# Altium schematic sheet SoC_PS.SchDoc: RFSOC_AMC
size 420 x 297 mm; Author: G.Kasprowicz; CompanyName: WUT ISE; DrawnBy: G.Kasprowicz; Organization: WUT ISE; Address1: PW ISE; Address2: Nowowiejska 15/19 00-665 Warsaw; Address3: gkasprow@gmail.com; DocumentNumber: 38; Revision: 2; SheetNumber: 38; SheetTotal: 54; ModifiedBy: -; CheckedDate: -; Title2: 8 channel ADC & DAC; DivGrp: WUT ISE; Designer: G.Kasprowicz; ModifiedDate: -; ProjectName: Sensor Box
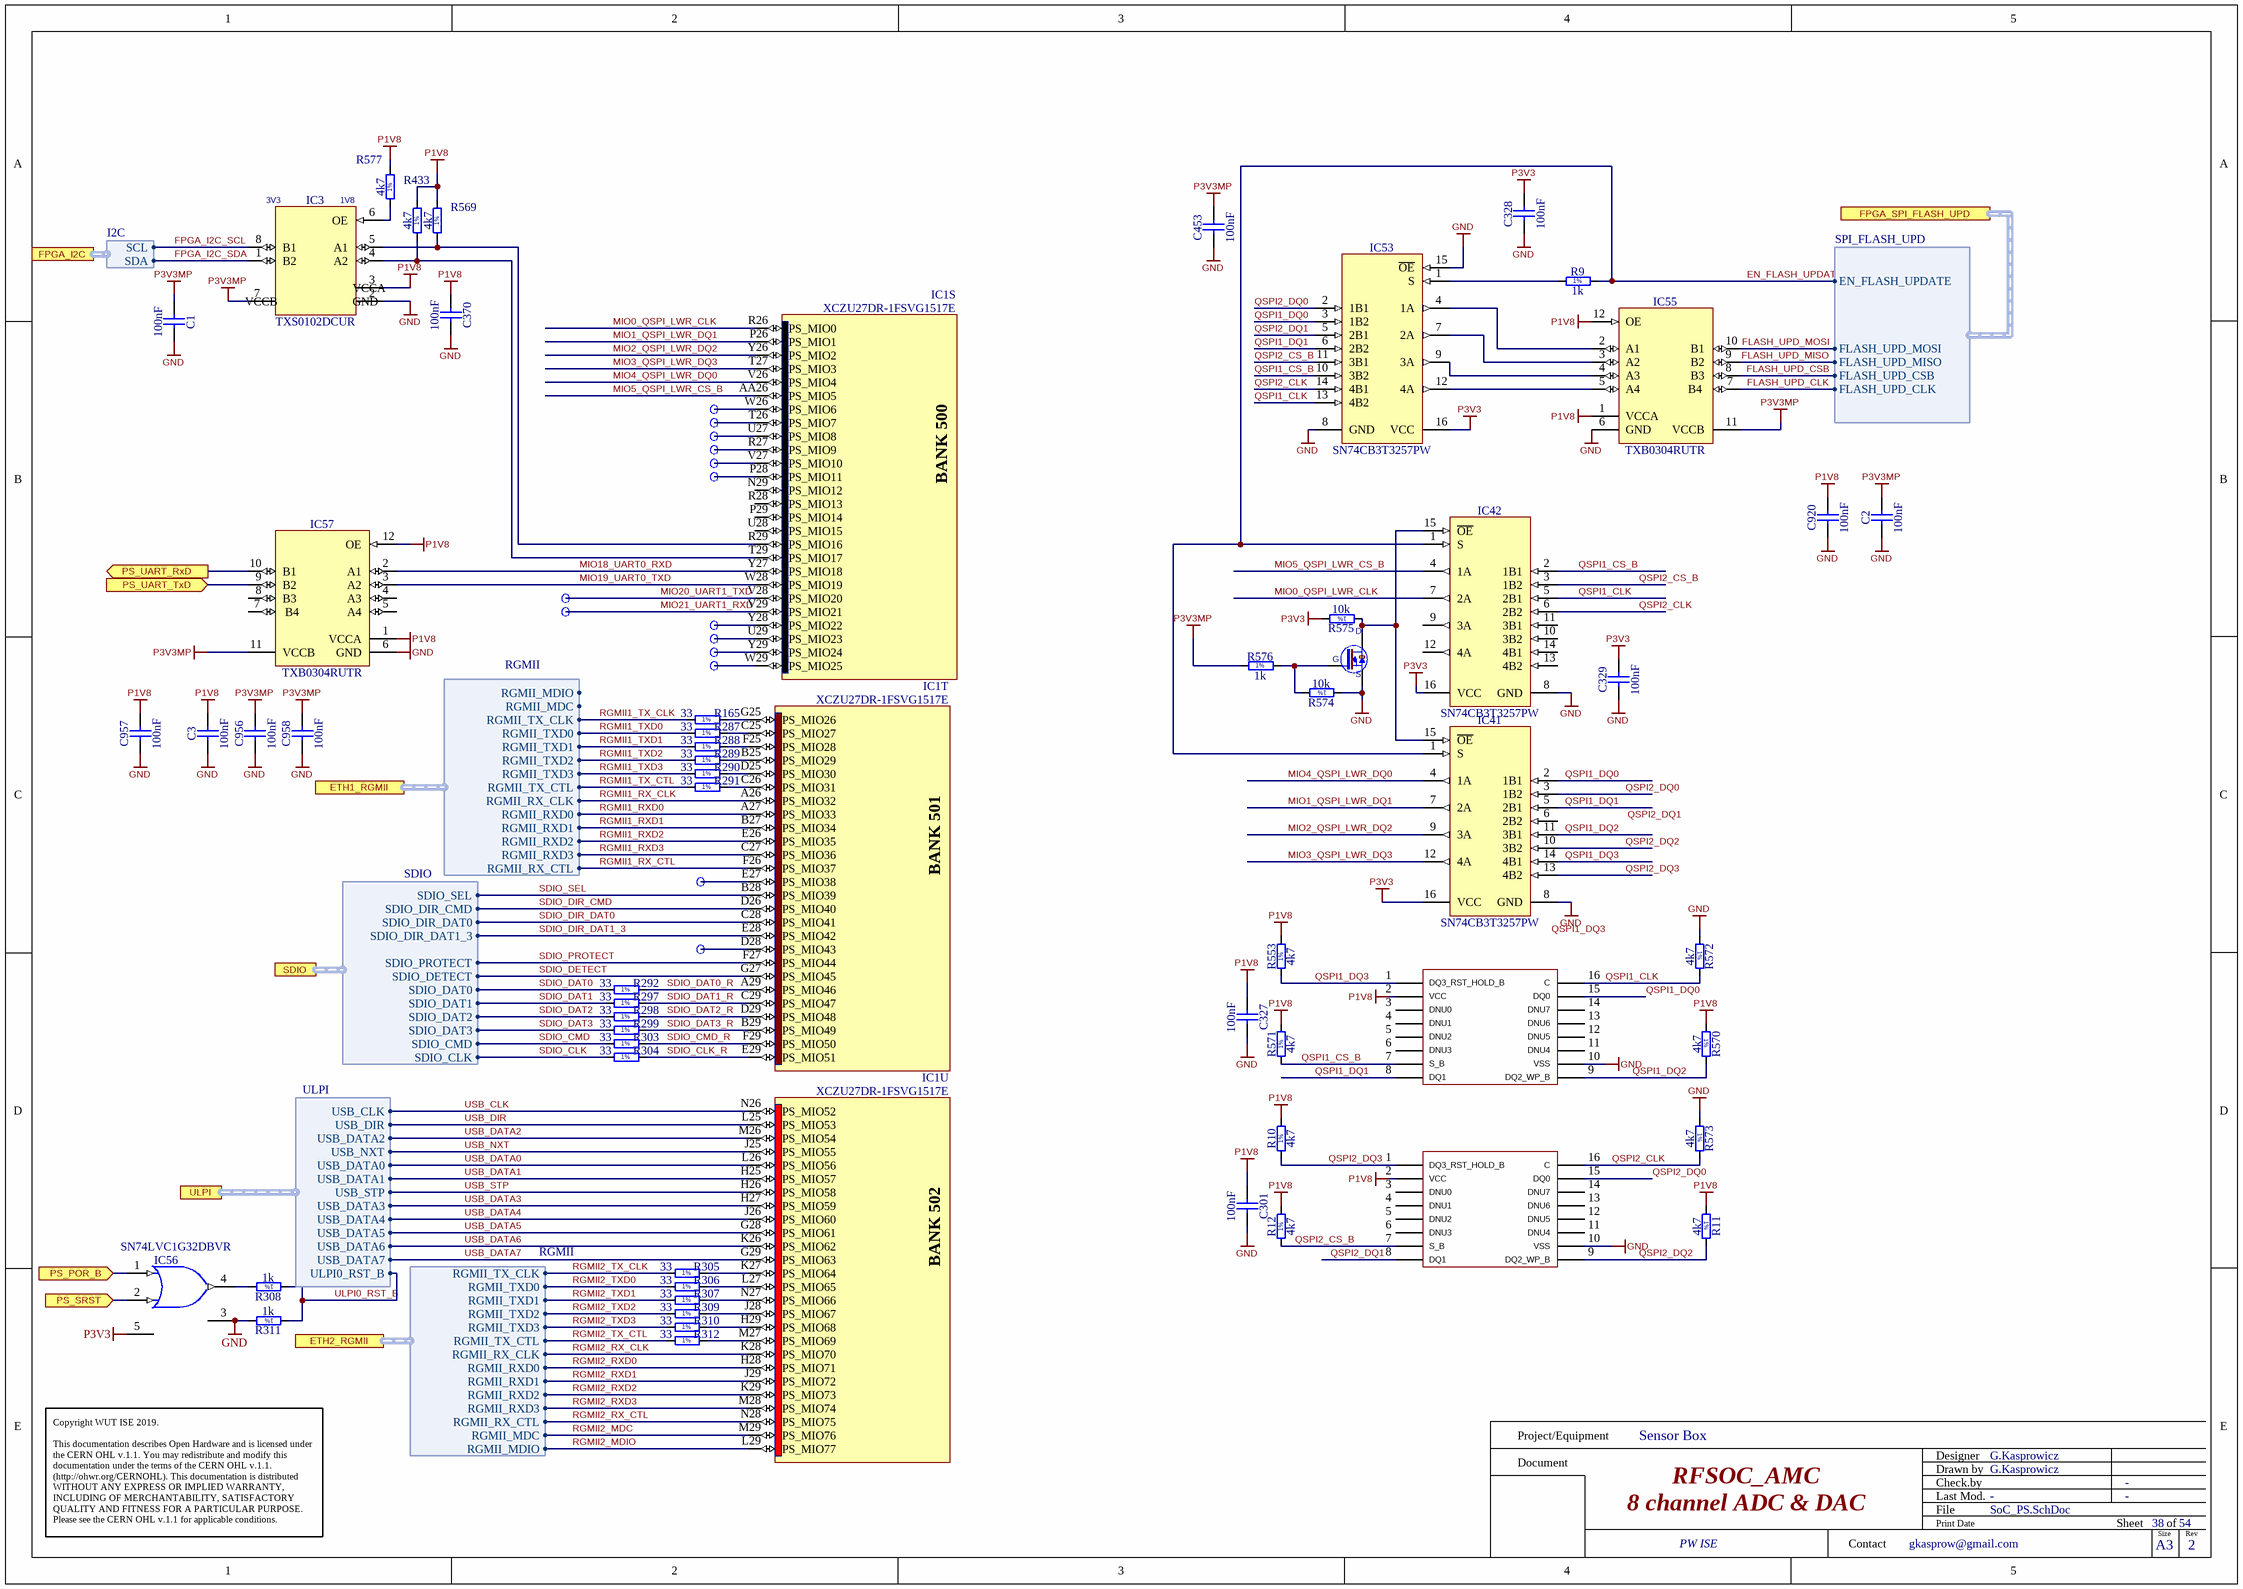
[diagram p0: SoC_PS.SchDoc]

## Parts
C1  100nF  [CAPC0603X33N]
C2  100nF  [CAPC0603X33N]
C3  100nF  [CAPC0603X33N]
C301  100nF  [CAPC0603X33N]
C327  100nF  [CAPC0603X33N]
C328  100nF  [CAPC0603X33N]
C329  100nF  [CAPC0603X33N]
C370  100nF  [CAPC0603X33N]
C453  100nF  [CAPC0603X33N]
C920  100nF  [CAPC0603X33N]
C956  100nF  [CAPC0603X33N]
C957  100nF  [CAPC0603X33N]
C958  100nF  [CAPC0603X33N]
IC1  XCZU27DR-1FSVG1517E  [XILINX_FSVG1517 (XCZU27DR)]  (parts S,T,U of 31)
IC3  TXS0102DCUR  [SOP50P310X90-8N]
IC37  MT25QU512ABB8ESF  [SOIC127P1032X265-16N]  (value not drawn)
IC40  MT25QU512ABB8ESF  [SOIC127P1032X265-16N]  (value not drawn)
IC41  SN74CB3T3257PW  [SOP65P640X120-16N]
IC42  SN74CB3T3257PW  [SOP65P640X120-16N]
IC53  SN74CB3T3257PW  [SOP65P640X120-16N]
IC55  TXB0304RUTR  [TEXAS_RUT (R-PUQFN-N12)]
IC56  SN74LVC1G32DBVR  [SOT95P280X145-5N]
IC57  TXB0304RUTR  [TEXAS_RUT (R-PUQFN-N12)]
R9  1k  [RESC1005X40N]
R10  4k7  [RESC1005X40N]
R11  4k7  [RESC1005X40N]
R12  4k7  [RESC1005X40N]
R165  33  [RESC1005X40N]
R287  33  [RESC1005X40N]
R288  33  [RESC1005X40N]
R289  33  [RESC1005X40N]
R290  33  [RESC1005X40N]
R291  33  [RESC1005X40N]
R292  33  [RESC1005X40N]
R297  33  [RESC1005X40N]
R298  33  [RESC1005X40N]
R299  33  [RESC1005X40N]
R303  33  [RESC1005X40N]
R304  33  [RESC1005X40N]
R305  33  [RESC1005X40N]
R306  33  [RESC1005X40N]
R307  33  [RESC1005X40N]
R308  1k  [RESC1005X40N]
R309  33  [RESC1005X40N]
R310  33  [RESC1005X40N]
R311  1k  [RESC1005X40N]
R312  33  [RESC1005X40N]
R433  4k7  [RESC1005X40N]
R553  4k7  [RESC1005X40N]
R569  4k7  [RESC1005X40N]
R570  4k7  [RESC1005X40N]
R571  4k7  [RESC1005X40N]
R572  4k7  [RESC1005X40N]
R573  4k7  [RESC1005X40N]
R574  10k  [RESC1005X40N]
R575  10k  [RESC1005X40N]
R576  1k  [RESC1005X40N]
R577  4k7  [RESC1005X40N]
T22  BSS138LT1G  (value not drawn)
TP11  SMD_PAD_D1MM  (value not drawn)
TP12  SMD_PAD_D1MM  (value not drawn)
TP13  SMD_PAD_D1MM  (value not drawn)
TP14  SMD_PAD_D1MM  (value not drawn)
TP15  SMD_PAD_D1MM  (value not drawn)
TP16  SMD_PAD_D1MM  (value not drawn)
TP17  SMD_PAD_D1MM  (value not drawn)
TP18  SMD_PAD_D1MM  (value not drawn)
TP19  SMD_PAD_D1MM  (value not drawn)
TP20  SMD_PAD_D1MM  (value not drawn)
TP21  SMD_PAD_D1MM  (value not drawn)
TP22  SMD_PAD_D1MM  (value not drawn)
TP23  SMD_PAD_D1MM  (value not drawn)
TP24  SMD_PAD_D1MM  (value not drawn)

## Ports
ETH1_RGMII (harness RGMII), ETH2_RGMII (harness RGMII), FPGA_I2C (harness I2C), FPGA_SPI_FLASH_UPD (harness SPI_FLASH_UPD), PS_POR_B (in), PS_SRST (in), PS_UART_RxD (out), PS_UART_TxD (in), SDIO (harness SDIO), ULPI (harness ULPI)

## Harnesses
SDIO: SDIO_SEL, SDIO_DIR_CMD, SDIO_DIR_DAT0, SDIO_DIR_DAT1_3, SDIO_PROTECT, SDIO_DETECT, SDIO_DAT0, SDIO_DAT1, SDIO_DAT2, SDIO_DAT3, SDIO_CMD, SDIO_CLK
SPI_FLASH_UPD: EN_FLASH_UPDATE, FLASH_UPD_MOSI, FLASH_UPD_MISO, FLASH_UPD_CSB, FLASH_UPD_CLK
I2C: SCL, SDA
ULPI: USB_CLK, USB_DIR, USB_DATA2, USB_NXT, USB_DATA0, USB_DATA1, USB_STP, USB_DATA3, USB_DATA4, USB_DATA5, USB_DATA6, USB_DATA7, ULPI0_RST_B
RGMII: RGMII_TX_CLK, RGMII_TXD0, RGMII_TXD1, RGMII_TXD2, RGMII_TXD3, RGMII_TX_CTL, RGMII_RX_CLK, RGMII_RXD0, RGMII_RXD1, RGMII_RXD2, RGMII_RXD3, RGMII_RX_CTL, RGMII_MDC, RGMII_MDIO

## Nets
GND: C1.1 C2.1 C3.1 C301.1 C327.1 C328.1 C329.1 C370.1 C453.1 C920.1 C956.1 C957.1 C958.1 IC3.2(GND) IC37.10(VSS) IC40.10(VSS) IC41.8(GND) IC42.8(GND) IC53.8(GND) IC53.15(~{OE}) IC55.6(GND) IC56.3(GND) IC57.6(GND) R311.2 R572.1 R573.1 R574.1 T22.2(S)
P1V8: C3.2 C301.2 C327.2 C370.2 C920.2 C957.2 IC3.3(Vcca) IC37.2(VCC) IC40.2(VCC) IC55.1(VCCA) IC55.12(OE) IC57.1(VCCA) IC57.12(OE) R10.2 R11.1 R12.2 R433.2 R553.2 R569.2 R570.1 R571.2 R577.2
P3V3: C328.2 C329.2 IC41.16(VCC) IC42.16(VCC) IC53.16(VCC) IC56.5(VCC) R575.2
P3V3MP: C1.2 C2.2 C453.2 C956.2 C958.2 IC3.7(Vccb) IC55.11(VCCB) IC57.11(VCCB) R576.1
EN_FLASH_UPDATE: IC41.1(S) IC42.1(S) R9.2 ; port FPGA_SPI_FLASH_UPD.EN_FLASH_UPDATE
FLASH_UPD_CLK: IC55.7(B4) ; port FPGA_SPI_FLASH_UPD.FLASH_UPD_CLK
FLASH_UPD_CSB: IC55.8(B3) ; port FPGA_SPI_FLASH_UPD.FLASH_UPD_CSB
FLASH_UPD_MISO: IC55.9(B2) ; port FPGA_SPI_FLASH_UPD.FLASH_UPD_MISO
FLASH_UPD_MOSI: IC55.10(B1) ; port FPGA_SPI_FLASH_UPD.FLASH_UPD_MOSI
FPGA_I2C_SCL: IC3.8(B1) ; port FPGA_I2C.SCL
FPGA_I2C_SDA: IC3.1(B2) ; port FPGA_I2C.SDA
MIO0_QSPI_LWR_CLK: IC1.R26(PS_MIO0) IC42.7(2A)
MIO1_QSPI_LWR_DQ1: IC1.P26(PS_MIO1) IC41.7(2A)
MIO2_QSPI_LWR_DQ2: IC1.Y26(PS_MIO2) IC41.9(3A)
MIO3_QSPI_LWR_DQ3: IC1.T27(PS_MIO3) IC41.12(4A)
MIO4_QSPI_LWR_DQ0: IC1.V26(PS_MIO4) IC41.4(1A)
MIO5_QSPI_LWR_CS_B: IC1.AA26(PS_MIO5) IC42.4(1A)
MIO18_UART0_RXD: IC1.Y27(PS_MIO18) IC57.2(A1)
MIO19_UART0_TXD: IC1.W28(PS_MIO19) IC57.3(A2)
MIO20_UART1_TXD: IC1.V28(PS_MIO20) TP22.1
MIO21_UART1_RXD: IC1.V29(PS_MIO21) TP23.1
PS_POR_B: IC56.1(A) ; port PS_POR_B
PS_SRST: IC56.2(B) ; port PS_SRST
PS_UART_RxD: IC57.10(B1) ; port PS_UART_RxD
PS_UART_TxD: IC57.9(B2) ; port PS_UART_TxD
QSPI1_CLK: IC37.16(C) IC42.5(2B1) IC53.13(4B2) R572.2
QSPI1_CS_B: IC37.7(S_B) IC42.2(1B1) IC53.10(3B2) R571.1
QSPI1_DQ0: IC37.15(DQ0) IC41.2(1B1) IC53.3(1B2)
QSPI1_DQ1: IC37.8(DQ1) IC41.5(2B1) IC53.6(2B2)
QSPI1_DQ2: IC37.9(DQ2_WP_B) IC41.11(3B1) R570.2
QSPI1_DQ3: IC37.1(DQ3_RST_HOLD_B) IC41.14(4B1) R553.1
QSPI2_CLK: IC40.16(C) IC42.6(2B2) IC53.14(4B1) R573.2
QSPI2_CS_B: IC40.7(S_B) IC42.3(1B2) IC53.11(3B1) R12.1
QSPI2_DQ0: IC40.15(DQ0) IC41.3(1B2) IC53.2(1B1)
QSPI2_DQ1: IC40.8(DQ1) IC53.5(2B1)
QSPI2_DQ2: IC40.9(DQ2_WP_B) IC41.10(3B2) R11.2
QSPI2_DQ3: IC40.1(DQ3_RST_HOLD_B) IC41.13(4B2) R10.1
RGMII1_RX_CLK: IC1.A26(PS_MIO32) ; port ETH1_RGMII.RGMII_RX_CLK
RGMII1_RX_CTL: IC1.F26(PS_MIO37) ; port ETH1_RGMII.RGMII_RX_CTL
RGMII1_RXD0: IC1.A27(PS_MIO33) ; port ETH1_RGMII.RGMII_RXD0
RGMII1_RXD1: IC1.B27(PS_MIO34) ; port ETH1_RGMII.RGMII_RXD1
RGMII1_RXD2: IC1.E26(PS_MIO35) ; port ETH1_RGMII.RGMII_RXD2
RGMII1_RXD3: IC1.C27(PS_MIO36) ; port ETH1_RGMII.RGMII_RXD3
RGMII1_TX_CLK: R165.1 ; port ETH1_RGMII.RGMII_TX_CLK
RGMII1_TX_CTL: R291.1 ; port ETH1_RGMII.RGMII_TX_CTL
RGMII1_TXD0: R287.1 ; port ETH1_RGMII.RGMII_TXD0
RGMII1_TXD1: R288.1 ; port ETH1_RGMII.RGMII_TXD1
RGMII1_TXD2: R289.1 ; port ETH1_RGMII.RGMII_TXD2
RGMII1_TXD3: R290.1 ; port ETH1_RGMII.RGMII_TXD3
RGMII2_MDC: IC1.M29(PS_MIO76) ; port ETH2_RGMII.RGMII_MDC
RGMII2_MDIO: IC1.L29(PS_MIO77) ; port ETH2_RGMII.RGMII_MDIO
RGMII2_RX_CLK: IC1.K28(PS_MIO70) ; port ETH2_RGMII.RGMII_RX_CLK
RGMII2_RX_CTL: IC1.N28(PS_MIO75) ; port ETH2_RGMII.RGMII_RX_CTL
RGMII2_RXD0: IC1.H28(PS_MIO71) ; port ETH2_RGMII.RGMII_RXD0
RGMII2_RXD1: IC1.J29(PS_MIO72) ; port ETH2_RGMII.RGMII_RXD1
RGMII2_RXD2: IC1.K29(PS_MIO73) ; port ETH2_RGMII.RGMII_RXD2
RGMII2_RXD3: IC1.M28(PS_MIO74) ; port ETH2_RGMII.RGMII_RXD3
RGMII2_TX_CLK: R305.1 ; port ETH2_RGMII.RGMII_TX_CLK
RGMII2_TX_CTL: R312.1 ; port ETH2_RGMII.RGMII_TX_CTL
RGMII2_TXD0: R306.1 ; port ETH2_RGMII.RGMII_TXD0
RGMII2_TXD1: R307.1 ; port ETH2_RGMII.RGMII_TXD1
RGMII2_TXD2: R309.1 ; port ETH2_RGMII.RGMII_TXD2
RGMII2_TXD3: R310.1 ; port ETH2_RGMII.RGMII_TXD3
SDIO_CLK: R304.1 ; port SDIO.SDIO_CLK
SDIO_CLK_R: IC1.E29(PS_MIO51) R304.2
SDIO_CMD: R303.1 ; port SDIO.SDIO_CMD
SDIO_CMD_R: IC1.F29(PS_MIO50) R303.2
SDIO_DAT0: R292.1 ; port SDIO.SDIO_DAT0
SDIO_DAT0_R: IC1.A29(PS_MIO46) R292.2
SDIO_DAT1: R297.1 ; port SDIO.SDIO_DAT1
SDIO_DAT1_R: IC1.C29(PS_MIO47) R297.2
SDIO_DAT2: R298.1 ; port SDIO.SDIO_DAT2
SDIO_DAT2_R: IC1.D29(PS_MIO48) R298.2
SDIO_DAT3: R299.1 ; port SDIO.SDIO_DAT3
SDIO_DAT3_R: IC1.B29(PS_MIO49) R299.2
SDIO_DETECT: IC1.G27(PS_MIO45) ; port SDIO.SDIO_DETECT
SDIO_DIR_CMD: IC1.D26(PS_MIO40) ; port SDIO.SDIO_DIR_CMD
SDIO_DIR_DAT0: IC1.C28(PS_MIO41) ; port SDIO.SDIO_DIR_DAT0
SDIO_DIR_DAT1_3: IC1.E28(PS_MIO42) ; port SDIO.SDIO_DIR_DAT1_3
SDIO_PROTECT: IC1.F27(PS_MIO44) ; port SDIO.SDIO_PROTECT
SDIO_SEL: IC1.B28(PS_MIO39) ; port SDIO.SDIO_SEL
ULPI0_RST_B: R308.1 R311.1 ; port ULPI.ULPI0_RST_B
USB_CLK: IC1.N26(PS_MIO52) ; port ULPI.USB_CLK
USB_DATA0: IC1.L26(PS_MIO56) ; port ULPI.USB_DATA0
USB_DATA1: IC1.H25(PS_MIO57) ; port ULPI.USB_DATA1
USB_DATA2: IC1.M26(PS_MIO54) ; port ULPI.USB_DATA2
USB_DATA3: IC1.H27(PS_MIO59) ; port ULPI.USB_DATA3
USB_DATA4: IC1.J26(PS_MIO60) ; port ULPI.USB_DATA4
USB_DATA5: IC1.G28(PS_MIO61) ; port ULPI.USB_DATA5
USB_DATA6: IC1.K26(PS_MIO62) ; port ULPI.USB_DATA6
USB_DATA7: IC1.G29(PS_MIO63) ; port ULPI.USB_DATA7
USB_DIR: IC1.L25(PS_MIO53) ; port ULPI.USB_DIR
USB_NXT: IC1.J25(PS_MIO55) ; port ULPI.USB_NXT
USB_STP: IC1.H26(PS_MIO58) ; port ULPI.USB_STP
NetIC1_B25: IC1.B25(PS_MIO29) R289.2
NetIC1_C25: IC1.C25(PS_MIO27) R287.2
NetIC1_C26: IC1.C26(PS_MIO31) R291.2
NetIC1_D25: IC1.D25(PS_MIO30) R290.2
NetIC1_D28: IC1.D28(PS_MIO43) TP24.1
NetIC1_E27: IC1.E27(PS_MIO38) TP21.1
NetIC1_F25: IC1.F25(PS_MIO28) R288.2
NetIC1_G25: IC1.G25(PS_MIO26) R165.2
NetIC1_H29: IC1.H29(PS_MIO68) R310.2
NetIC1_J28: IC1.J28(PS_MIO67) R309.2
NetIC1_K27: IC1.K27(PS_MIO64) R305.2
NetIC1_L27: IC1.L27(PS_MIO65) R306.2
NetIC1_M27: IC1.M27(PS_MIO69) R312.2
NetIC1_N27: IC1.N27(PS_MIO66) R307.2
NetIC1_P28: IC1.P28(PS_MIO11) TP16.1
NetIC1_R27: IC1.R27(PS_MIO9) TP14.1
NetIC1_R29: IC1.R29(PS_MIO16) IC3.5(A1) R569.1
NetIC1_T26: IC1.T26(PS_MIO7) TP12.1
NetIC1_T29: IC1.T29(PS_MIO17) IC3.4(A2) R433.1
NetIC1_U27: IC1.U27(PS_MIO8) TP13.1
NetIC1_U29: IC1.U29(PS_MIO23) TP18.1
NetIC1_V27: IC1.V27(PS_MIO10) TP15.1
NetIC1_W26: IC1.W26(PS_MIO6) TP11.1
NetIC1_W29: IC1.W29(PS_MIO25) TP20.1
NetIC1_Y28: IC1.Y28(PS_MIO22) TP17.1
NetIC1_Y29: IC1.Y29(PS_MIO24) TP19.1
NetIC3_6: IC3.6(OE) R577.1
NetIC41_15: IC41.15(~{OE}) IC42.15(~{OE}) R575.1 T22.3(D)
NetIC53_1: IC53.1(S) R9.1
NetIC53_4: IC53.4(1A) IC55.2(A1)
NetIC53_7: IC53.7(2A) IC55.3(A2)
NetIC53_9: IC53.9(3A) IC55.4(A3)
NetIC53_12: IC53.12(4A) IC55.5(A4)
NetIC56_4: IC56.4(Y) R308.2
NetR574_2: R574.2 R576.2 T22.1(G)

Not connected (* = marked no-connect by the designer): IC1 N29(PS_MIO12) P29(PS_MIO14) R28(PS_MIO13) U28(PS_MIO15); IC37 3(DNU0) 4(DNU1) 5(DNU2) 6(DNU3) 11(DNU4) 12(DNU5) 13(DNU6) 14(DNU7); IC40 3(DNU0) 4(DNU1) 5(DNU2) 6(DNU3) 11(DNU4) 12(DNU5) 13(DNU6) 14(DNU7); IC41 6(2B2); IC42 9(3A) 10(3B2) 11(3B1) 12(4A) 13(4B2) 14(4B1); IC57 4(A3) 5(A4) 7(B4) 8(B3)

## Notes on the sheet
- (near IC3) 3V3
- (near IC3) 1V8
- Labels drawn without touching a wire or pin: QSPI1_DQ3, QSPI2_DQ1
- Project/Equipment
- Document
- Designer
- Drawn by
- Check.by
- Copyright WUT ISE 2019.
  This documentation describes Open Hardware and is licensed under the CERN OHL v.1.1. You may redistribute and modify this documentation under the terms of the CERN OHL v.1.1. (http://ohwr.org/CERNOHL). This documentation is distributed WITHOUT ANY EXPRESS OR IMPLIED WARRANTY, INCLUDING OF MERCHANTABILITY, SATISFACTORY QUALITY AND FITNESS FOR A PARTICULAR PURPOSE. Please see the CERN OHL v.1.1 for applicable conditions.
- Contact
- File
- Last Mod.
- Print Date
- Sheet
- Size
- A3
- of
- Rev
- (in symbol R0402_1K_1%_0.0625W_100PPM) 1%
- (in symbol R0402_4K7_1%_0.0625W_100PPM) 1%
- (in symbol R0402_10K_1%_0.0625W_100PPM) 1%
- (in symbol R0402_33R_1%_0.0625W_100PPM) 1%
- (in symbol TXS0102DCUR) VCCA; VCCB
- (in symbol XCZU27DR-1FSVG1517E, part S) BANK 500
- (in symbol XCZU27DR-1FSVG1517E, part T) BANK 501
- (in symbol XCZU27DR-1FSVG1517E, part U) BANK 502

## Library data of the parts
C1-C3 C301 C327-C329 C370 C453 C920 C956-C958 = CC0201_100NF_6.3V_10%_X5R: Non-polarised capacitor; Manufacturer: GENERIC; Part Description: SMD Multilayer Chip Ceramic Capacitor; Manufacturer1 Part Number: 02016D104KAT2A; Tolerance: ±10%; Voltage: 6.3V; TC: X5R; Manufacturer Part Number: CC0201_100NF_6.3V_10%_X5R; Part Number: CC0201_100NF_6.3V_10%_X5R; Value: 100nF; Component Kind: Standard; Component Type: Standard; Pin Count: 2; Status: Not Recommended; Case: 0201; Mounted: Yes; Socket: No; SMD: Yes; Sense: No; Manufacturer1 Example: AVX; Manufacturer1 ComponentHeight: 0.33mm; HelpURL: \\cern.ch\dfs\Applications\Altium\Datasheets\CC0201_X5R_AVX.pdf; Author: CERN DEM JLC; CreateDate: 03/12/2007; LatestRevisionDate: 03/12/2007
IC1 = XCZU27DR-1FSVG1517E: Zynq UltraScale+ RFSoC, Quad-Core ARM® Cortex™-A53 MPCore™ up to 1.5GHz, 214 PS I/O, 299 HP I/O, 48 HD I/O, 1517-Pin BGA; Manufacturer: XILINX; PressFit: No; Bonding: No; Part Number: XCZU27DR-1FSVG1517E; Component Kind: Standard; Component Type: Standard; Device: XCZU27DR-1FSVG1517E; PackageDescription: BGA, 1.00mm Pitch, Square; 1517 Pin, 39 Columns X 39 Rows, 40.00mm X 40.00mm X 4.01mm H; Part Description: Zynq UltraScale+ RFSoC, Quad-Core ARM® Cortex™-A53 MPCore™ up to 1.5GHz, 214 PS I/O, 299 HP I/O, 48 HD I/O, 1517-Pin BGA; Manufacturer Part Number: XCZU27DR-1FSVG1517E; Pin Count: 1517; Case: BGA1517; Mounted: Yes; Socket: No; SMD: Yes; Sense: No; ComponentHeight: 4.01mm; HelpURL: \\cern.ch\dfs\Applications\Altium\Datasheets\XCZU27DR-1FSVG1517E.pdf; ComponentLink1URL: \\cern.ch\dfs\Applications\Altium\Datasheets\XCZU27DR-1FSVG1517E_Package-Pinout.pdf; ComponentLink1Description: Package/Pinout; ComponentLink2URL: \\cern.ch\dfs\Applications\Altium\Datasheets\XCZU27DR-1FSVG1517E_Pinout.pdf; ComponentLink2Description: Pinout; Author: CERN DEM MR; CreateDate: 02/05/2018; LatestRevisionDate: 02/05/2018
IC3 = TXS0102DCUR: 2-Bit Bidirectionnal Voltage-Level Translator for Open-Drain And Push-Pull Applications; Manufacturer: TEXAS INSTRUMENTS; PressFit: No; Bonding: No; Manufacturer Part Number: TXS0102DCUR; PackageDescription: SOP, 0.50mm Pitch; 8 pin, 2.30mm W X 2.00mm L X 0.90mm H body, PC Medium Density; Part Description: 2-Bit Bidirectionnal Voltage-Level Translator for Open-Drain And Push-Pull Applications; Part Number: TXS0102DCUR; Component Kind: Standard; Component Type: Standard; Device: TXS0102DCUR; Pin Count: 8; Case: TSSOP8; Mounted: Yes; Socket: No; SMD: Yes; Sense: No; ComponentHeight: 0.9mm; Author: CERN DEM JLC; HelpURL: \\cern.ch\dfs\Applications\Altium\Datasheets\TXS0102DCUR.pdf; CreateDate: 08/07/2014; LatestRevisionDate: 08/07/2014
IC37 = (no symbol name): Part Description: 512MBIT, MULTI-IO SERIAL NOR FLASH W RESET, 1.8V, SO16_WIDE; PARTS: 1; $$Internal_Resolution: 00001mm; $$NotCommonProperty_Case: SO16 wide; $$NotCommonProperty_Device: MT25QU512ABB8ESF-0SIT; $$NotCommonProperty_MANF: MICRON; $$NotCommonProperty_Voltage: 1.8V; CmpIndex: 401; DXDB_LIBNAME: MISC_GK; Ref Designator: IC37; SymIndex: 2105; $$Internal___BlkDate: 22:15:04_12-30-17; $$NotCommonProperty_MANF_P/N: MT25QU512ABB8ESF-0SIT; Cell Name: SOIC127P1032X265-16N; Manufacturer Part Number: MT25QU512ABB8ESF-0SIT; Manufacturer: Micron; Part Name: MT25QU512ABB8ESF-0SIT; Part Number: MT25QU512ABB8ESF-0SIT; Value: MT25QU512ABB8ESF; Orientation: 0 = 0
IC40 = (no symbol name): Part Description: 512MBIT, MULTI-IO SERIAL NOR FLASH W RESET, 1.8V, SO16_WIDE; PARTS: 1; $$Internal_Resolution: 00001mm; $$NotCommonProperty_Case: SO16 wide; $$NotCommonProperty_Device: MT25QU512ABB8ESF-0SIT; $$NotCommonProperty_MANF: MICRON; $$NotCommonProperty_Voltage: 1.8V; CmpIndex: 253; DXDB_LIBNAME: MISC_GK; Ref Designator: IC40; SymIndex: 2105; $$Internal___BlkDate: 22:15:04_12-30-17; $$NotCommonProperty_MANF_P/N: MT25QU512ABB8ESF-0SIT; Cell Name: SOIC127P1032X265-16N; Manufacturer Part Number: MT25QU512ABB8ESF-0SIT; Manufacturer: Micron; Part Name: MT25QU512ABB8ESF-0SIT; Part Number: MT25QU512ABB8ESF-0SIT; Value: MT25QU512ABB8ESF; Orientation: 0 = 0
IC41 IC42 IC53 = SN74CB3T3257PW: 4-BIT 1-OF-2 FET Multiplexer/Demultiplexer 2.5V/3.3V Low-Voltage Bus Switch 5V Tolerant Shifter; Manufacturer: TEXAS INSTRUMENTS; PressFit: No; Bonding: No; Manufacturer Part Number: SN74CB3T3257PW; PackageDescription: SOP, 0.65mm pitch; 16 pin, 4.40mm W X 5.00mm L X 1.20mm H body IPC Medium Density; Part Description: 4-Bit 1-of-2 FET Multiplexer/Demultiplexer 2.5V/3.3V Low-Voltage Bus Switch 5V Tolerant Shifter; Part Number: SN74CB3T3257PW; Component Kind: Standard; Component Type: Standard; Device: SN74CB3T3257PW; Pin Count: 16; Case: TSSOP16; Mounted: Yes; Socket: No; SMD: Yes; Sense: No; ComponentHeight: 1.2mm; Author: CERN DEM JLC; HelpURL: \\cern.ch\dfs\Applications\Altium\Datasheets\SN74CB3T3257PW.pdf; CreateDate: 30/01/2012; LatestRevisionDate: 30/01/2012
IC55 IC57 = TXB0304RUTR: 4-bit Bidirectional Auto-direction Sensing Translator with Fully Symmetric 0.9V to 3.6V Range; Manufacturer: TEXAS INSTRUMENTS; PressFit: No; Bonding: No; Manufacturer Part Number: TXB0304RUTR; PackageDescription: SON, TEXAS RUT (R-PUQFN-N12), 0.50mm Pitch, 12-pin, 1.70mm W  X 2.00mm L X 0.55mm Height; Part Description: 4-bit Bidirectional Auto-direction Sensing Translator with Fully Symmetric 0.9V to 3.6V Range; Part Number: TXB0304RUTR; Component Kind: Standard; Component Type: Standard; Device: TXB0304RUTR; Pin Count: 12; Case: QFN12; Mounted: Yes; Socket: No; SMD: Yes; Sense: No; ComponentHeight: 0.55mm; Author: CERN DEM JLC; HelpURL: \\cern.ch\dfs\Applications\Altium\Datasheets\TXB0304RUTR.pdf; CreateDate: 27/10/2014; LatestRevisionDate: 28/10/2014
IC56 = SN74LVC1G32DBVR: Single 2-Input Positive-OR Gate; Manufacturer: TEXAS INSTRUMENTS; PressFit: No; Bonding: No; Manufacturer Part Number: SN74LVC1G32DBVR; PackageDescription: SOT, 0.95mm pitch; 5 pin, 1.60mm W X 2.90mm L X 1.45mm H body, IPC Medium Density; Part Description: Single 2-Input Positive-OR Gate; Part Number: SN74LVC1G32DBVR; Component Kind: Standard; Component Type: Standard; Device: SN74LVC1G32DBVR; Pin Count: 5; Case: SOT23-5; Mounted: Yes; Socket: No; SMD: Yes; Sense: No; ComponentHeight: 1.45mm; Author: CERN DEM JLC; HelpURL: \\cern.ch\dfs\Applications\Altium\Datasheets\SN74LVC1G32DBVR.pdf; CreateDate: 25/04/2012; LatestRevisionDate: 25/04/2012
R9 R576 = R0402_1K_1%_0.0625W_100PPM: Resistor - 1%; Manufacturer: GENERIC; Part Description: General Purpose Thick Film Chip Resistor; Manufacturer1 Part Number: 232270671002L; TC: ±100ppm/°C; PressFit: No; Manufacturer Part Number: R0402_1K_1%_0.0625W_100PPM; Part Number: R0402_1K_1%_0.0625W_100PPM; Tolerance: ±1%; Value: 1k; Component Kind: Standard; Component Type: Standard; Pin Count: 2; Status: Not Recommended; Power: 0.0625W; Case: 0402; Mounted: Yes; Sense: No; Socket: No; SMD: Yes; Manufacturer1 Example: YAGEO PHYCOMP; Manufacturer1 ComponentHeight: 0.4mm; HelpURL: \\cern.ch\dfs\Applications\Altium\Datasheets\R0402_Phycomp_RC0402.pdf; Author: CERN DEM JLC; CreateDate: 03/12/2007; LatestRevisionDate: 17/10/2012
R10-R12 R433 R553 R569-R573 R577 = R0402_4K7_1%_0.0625W_100PPM: Resistor - 1%; Manufacturer: GENERIC; Part Description: General Purpose Thick Film Chip Resistor; Manufacturer1 Part Number: 232270674702L; TC: ±100ppm/°C; PressFit: No; Manufacturer Part Number: R0402_4K7_1%_0.0625W_100PPM; Part Number: R0402_4K7_1%_0.0625W_100PPM; Tolerance: ±1%; Value: 4k7; Component Kind: Standard; Component Type: Standard; Pin Count: 2; Status: Not Recommended; Power: 0.0625W; Case: 0402; Mounted: Yes; Sense: No; Socket: No; SMD: Yes; Manufacturer1 Example: YAGEO PHYCOMP; Manufacturer1 ComponentHeight: 0.4mm; HelpURL: \\cern.ch\dfs\Applications\Altium\Datasheets\R0402_Phycomp_RC0402.pdf; Author: CERN DEM JLC; CreateDate: 03/12/2007; LatestRevisionDate: 17/10/2012
R165 R287-R292 R297-R299 R303-R307 R309 R310 R312 = R0402_33R_1%_0.0625W_100PPM: Resistor - 1%; Part Description: General Purpose Thick Film Chip Resistor; Manufacturer: GENERIC; Manufacturer1 Part Number: 232270673309L; TC: ±100ppm/°C; PressFit: No; Part Number: R0402_33R_1%_0.0625W_100PPM; Component Kind: Standard; Component Type: Standard; Pin Count: 2; Value: 33; Status: Not Recommended; Power: 0.0625W; Tolerance: ±1%; Manufacturer Part Number: R0402_33R_1%_0.0625W_100PPM; Case: 0402; Mounted: Yes; Sense: No; Socket: No; SMD: Yes; Manufacturer1 Example: YAGEO PHYCOMP; Manufacturer1 ComponentHeight: 0.4mm; HelpURL: \\cern.ch\dfs\Applications\Altium\Datasheets\R0402_Phycomp_RC0402.pdf; Author: CERN DEM JLC; CreateDate: 03/12/2007; LatestRevisionDate: 17/10/2012
R308 R311 = R0402_1K_1%_0.0625W_100PPM: Resistor - 1%; Part Description: General Purpose Thick Film Chip Resistor; Manufacturer: GENERIC; Manufacturer1 Part Number: 232270671002L; TC: ±100ppm/°C; PressFit: No; Part Number: R0402_1K_1%_0.0625W_100PPM; Component Kind: Standard; Component Type: Standard; Pin Count: 2; Value: 1k; Status: Not Recommended; Power: 0.0625W; Tolerance: ±1%; Manufacturer Part Number: R0402_1K_1%_0.0625W_100PPM; Case: 0402; Mounted: Yes; Sense: No; Socket: No; SMD: Yes; Manufacturer1 Example: YAGEO PHYCOMP; Manufacturer1 ComponentHeight: 0.4mm; HelpURL: \\cern.ch\dfs\Applications\Altium\Datasheets\R0402_Phycomp_RC0402.pdf; Author: CERN DEM JLC; CreateDate: 03/12/2007; LatestRevisionDate: 17/10/2012
R574 R575 = R0402_10K_1%_0.0625W_100PPM: Resistor - 1%; Manufacturer: GENERIC; Part Description: General Purpose Thick Film Chip Resistor; Manufacturer1 Part Number: 232270671003L; TC: ±100ppm/°C; PressFit: No; Manufacturer Part Number: R0402_10K_1%_0.0625W_100PPM; Part Number: R0402_10K_1%_0.0625W_100PPM; Tolerance: ±1%; Value: 10k; Component Kind: Standard; Component Type: Standard; Pin Count: 2; Status: Not Recommended; Power: 0.0625W; Case: 0402; Mounted: Yes; Sense: No; Socket: No; SMD: Yes; Manufacturer1 Example: YAGEO PHYCOMP; Manufacturer1 ComponentHeight: 0.4mm; HelpURL: \\cern.ch\dfs\Applications\Altium\Datasheets\R0402_Phycomp_RC0402.pdf; Author: CERN DEM JLC; CreateDate: 03/12/2007; LatestRevisionDate: 17/10/2012
T22 = (no symbol name): Manufacturer: ON SEMICONDUCTOR; Part Description: 50V 200mA N-Channel Enhancement Mode Field-Effect Transistor; $$Internal_Resolution: 00001mm; $$NotCommonProperty_Bonding: No; $$NotCommonProperty_Case: SOT23-3; $$NotCommonProperty_Footprint Path: PcbLib\ICs And Semiconductors SMD.PcbLib; $$NotCommonProperty_Footprint Ref: SOT95P240X110-3N; $$NotCommonProperty_Mounted: Yes; $$NotCommonProperty_Pin Count: 3; $$NotCommonProperty_PressFit: No; CmpIndex: 303; DXDB_LIBNAME: Transistors; Ref Designator: T22; SymIndex: 1600; $$NotCommonProperty_ComponentHeight: 1.11mm; $$NotCommonProperty_Device: BSS138LT1G; $$NotCommonProperty_Sense: No; $$NotCommonProperty_SMD: Yes; $$NotCommonProperty_Socket: No; Cell Name: SOT95P240X110-3N; Footprint: SOT95P240X110-3N; Manufacturer Part Number: BSS138LT1G; PackageDescription: SOT23 3-Leads, Pitch 0.95mm - Body 1.4x3mm, IPC Medium Density; Part Name: BSS138LT1G; Part Number: BSS138LT1G; Orientation: 0 = 0
TP11 = (no symbol name): Part Description: 1mm Diameter SMD Pad; Partition: Pads; $$Internal_Resolution: 00001mm; $$NotCommonProperty_Family: SMD Pad; $$NotCommonProperty_Footprint Ref: C100; $$NotCommonProperty_Mounted: No; $$NotCommonProperty_Pin Count: 1; $$NotCommonProperty_Sense: No; $$NotCommonProperty_Status: None; CmpIndex: 220; Ref Designator: TP11; SymIndex: 2108; $$NotCommonProperty_ComponentHeight: 0mm; $$NotCommonProperty_SMD: No; $$NotCommonProperty_Socket: No; Cell Name: C100; Footprint: C100; PackageDescription: 1mm Diameter SMD Pad; Part Name: SMD_PAD_D1MM; Part Number: SMD_PAD_D1MM; Orientation: 0 = 0
TP12 = (no symbol name): Part Description: 1mm Diameter SMD Pad; Partition: Pads; $$Internal_Resolution: 00001mm; $$NotCommonProperty_Family: SMD Pad; $$NotCommonProperty_Footprint Ref: C100; $$NotCommonProperty_Mounted: No; $$NotCommonProperty_Pin Count: 1; $$NotCommonProperty_Sense: No; $$NotCommonProperty_Status: None; CmpIndex: 221; Ref Designator: TP12; SymIndex: 2108; $$NotCommonProperty_ComponentHeight: 0mm; $$NotCommonProperty_SMD: No; $$NotCommonProperty_Socket: No; Cell Name: C100; Footprint: C100; PackageDescription: 1mm Diameter SMD Pad; Part Name: SMD_PAD_D1MM; Part Number: SMD_PAD_D1MM; Orientation: 0 = 0
TP13 = (no symbol name): Part Description: 1mm Diameter SMD Pad; Partition: Pads; $$Internal_Resolution: 00001mm; $$NotCommonProperty_Family: SMD Pad; $$NotCommonProperty_Footprint Ref: C100; $$NotCommonProperty_Mounted: No; $$NotCommonProperty_Pin Count: 1; $$NotCommonProperty_Sense: No; $$NotCommonProperty_Status: None; CmpIndex: 222; Ref Designator: TP13; SymIndex: 2108; $$NotCommonProperty_ComponentHeight: 0mm; $$NotCommonProperty_SMD: No; $$NotCommonProperty_Socket: No; Cell Name: C100; Footprint: C100; PackageDescription: 1mm Diameter SMD Pad; Part Name: SMD_PAD_D1MM; Part Number: SMD_PAD_D1MM; Orientation: 0 = 0
TP14 = (no symbol name): Part Description: 1mm Diameter SMD Pad; Partition: Pads; $$Internal_Resolution: 00001mm; $$NotCommonProperty_Family: SMD Pad; $$NotCommonProperty_Footprint Ref: C100; $$NotCommonProperty_Mounted: No; $$NotCommonProperty_Pin Count: 1; $$NotCommonProperty_Sense: No; $$NotCommonProperty_Status: None; CmpIndex: 223; Ref Designator: TP14; SymIndex: 2108; $$NotCommonProperty_ComponentHeight: 0mm; $$NotCommonProperty_SMD: No; $$NotCommonProperty_Socket: No; Cell Name: C100; Footprint: C100; PackageDescription: 1mm Diameter SMD Pad; Part Name: SMD_PAD_D1MM; Part Number: SMD_PAD_D1MM; Orientation: 0 = 0
TP15 = (no symbol name): Part Description: 1mm Diameter SMD Pad; Partition: Pads; $$Internal_Resolution: 00001mm; $$NotCommonProperty_Family: SMD Pad; $$NotCommonProperty_Footprint Ref: C100; $$NotCommonProperty_Mounted: No; $$NotCommonProperty_Pin Count: 1; $$NotCommonProperty_Sense: No; $$NotCommonProperty_Status: None; CmpIndex: 224; Ref Designator: TP15; SymIndex: 2108; $$NotCommonProperty_ComponentHeight: 0mm; $$NotCommonProperty_SMD: No; $$NotCommonProperty_Socket: No; Cell Name: C100; Footprint: C100; PackageDescription: 1mm Diameter SMD Pad; Part Name: SMD_PAD_D1MM; Part Number: SMD_PAD_D1MM; Orientation: 0 = 0
TP16 = (no symbol name): Part Description: 1mm Diameter SMD Pad; Partition: Pads; $$Internal_Resolution: 00001mm; $$NotCommonProperty_Family: SMD Pad; $$NotCommonProperty_Footprint Ref: C100; $$NotCommonProperty_Mounted: No; $$NotCommonProperty_Pin Count: 1; $$NotCommonProperty_Sense: No; $$NotCommonProperty_Status: None; CmpIndex: 225; Ref Designator: TP16; SymIndex: 2108; $$NotCommonProperty_ComponentHeight: 0mm; $$NotCommonProperty_SMD: No; $$NotCommonProperty_Socket: No; Cell Name: C100; Footprint: C100; PackageDescription: 1mm Diameter SMD Pad; Part Name: SMD_PAD_D1MM; Part Number: SMD_PAD_D1MM; Orientation: 0 = 0
TP17 = (no symbol name): Part Description: 1mm Diameter SMD Pad; Partition: Pads; $$Internal_Resolution: 00001mm; $$NotCommonProperty_Family: SMD Pad; $$NotCommonProperty_Footprint Ref: C100; $$NotCommonProperty_Mounted: No; $$NotCommonProperty_Pin Count: 1; $$NotCommonProperty_Sense: No; $$NotCommonProperty_Status: None; CmpIndex: 226; Ref Designator: TP17; SymIndex: 2108; $$NotCommonProperty_ComponentHeight: 0mm; $$NotCommonProperty_SMD: No; $$NotCommonProperty_Socket: No; Cell Name: C100; Footprint: C100; PackageDescription: 1mm Diameter SMD Pad; Part Name: SMD_PAD_D1MM; Part Number: SMD_PAD_D1MM; Orientation: 0 = 0
TP18 = (no symbol name): Part Description: 1mm Diameter SMD Pad; Partition: Pads; $$Internal_Resolution: 00001mm; $$NotCommonProperty_Family: SMD Pad; $$NotCommonProperty_Footprint Ref: C100; $$NotCommonProperty_Mounted: No; $$NotCommonProperty_Pin Count: 1; $$NotCommonProperty_Sense: No; $$NotCommonProperty_Status: None; CmpIndex: 227; Ref Designator: TP18; SymIndex: 2108; $$NotCommonProperty_ComponentHeight: 0mm; $$NotCommonProperty_SMD: No; $$NotCommonProperty_Socket: No; Cell Name: C100; Footprint: C100; PackageDescription: 1mm Diameter SMD Pad; Part Name: SMD_PAD_D1MM; Part Number: SMD_PAD_D1MM; Orientation: 0 = 0
TP19 = (no symbol name): Part Description: 1mm Diameter SMD Pad; Partition: Pads; $$Internal_Resolution: 00001mm; $$NotCommonProperty_Family: SMD Pad; $$NotCommonProperty_Footprint Ref: C100; $$NotCommonProperty_Mounted: No; $$NotCommonProperty_Pin Count: 1; $$NotCommonProperty_Sense: No; $$NotCommonProperty_Status: None; CmpIndex: 228; Ref Designator: TP19; SymIndex: 2108; $$NotCommonProperty_ComponentHeight: 0mm; $$NotCommonProperty_SMD: No; $$NotCommonProperty_Socket: No; Cell Name: C100; Footprint: C100; PackageDescription: 1mm Diameter SMD Pad; Part Name: SMD_PAD_D1MM; Part Number: SMD_PAD_D1MM; Orientation: 0 = 0
TP20 = (no symbol name): Part Description: 1mm Diameter SMD Pad; Partition: Pads; $$Internal_Resolution: 00001mm; $$NotCommonProperty_Family: SMD Pad; $$NotCommonProperty_Footprint Ref: C100; $$NotCommonProperty_Mounted: No; $$NotCommonProperty_Pin Count: 1; $$NotCommonProperty_Sense: No; $$NotCommonProperty_Status: None; CmpIndex: 229; Ref Designator: TP20; SymIndex: 2108; $$NotCommonProperty_ComponentHeight: 0mm; $$NotCommonProperty_SMD: No; $$NotCommonProperty_Socket: No; Cell Name: C100; Footprint: C100; PackageDescription: 1mm Diameter SMD Pad; Part Name: SMD_PAD_D1MM; Part Number: SMD_PAD_D1MM; Orientation: 0 = 0
TP21 = (no symbol name): Part Description: 1mm Diameter SMD Pad; Partition: Pads; $$Internal_Resolution: 00001mm; $$NotCommonProperty_Family: SMD Pad; $$NotCommonProperty_Footprint Ref: C100; $$NotCommonProperty_Mounted: No; $$NotCommonProperty_Pin Count: 1; $$NotCommonProperty_Sense: No; $$NotCommonProperty_Status: None; CmpIndex: 230; Ref Designator: TP21; SymIndex: 2108; $$NotCommonProperty_ComponentHeight: 0mm; $$NotCommonProperty_SMD: No; $$NotCommonProperty_Socket: No; Cell Name: C100; Footprint: C100; PackageDescription: 1mm Diameter SMD Pad; Part Name: SMD_PAD_D1MM; Part Number: SMD_PAD_D1MM; Orientation: 0 = 0
TP22 = (no symbol name): Part Description: 1mm Diameter SMD Pad; Partition: Pads; $$Internal_Resolution: 00001mm; $$NotCommonProperty_Family: SMD Pad; $$NotCommonProperty_Footprint Ref: C100; $$NotCommonProperty_Mounted: No; $$NotCommonProperty_Pin Count: 1; $$NotCommonProperty_Sense: No; $$NotCommonProperty_Status: None; CmpIndex: 260; Ref Designator: TP22; SymIndex: 2108; $$NotCommonProperty_ComponentHeight: 0mm; $$NotCommonProperty_SMD: No; $$NotCommonProperty_Socket: No; Cell Name: C100; Footprint: C100; PackageDescription: 1mm Diameter SMD Pad; Part Name: SMD_PAD_D1MM; Part Number: SMD_PAD_D1MM; Orientation: 0 = 0
TP23 = (no symbol name): Part Description: 1mm Diameter SMD Pad; Partition: Pads; $$Internal_Resolution: 00001mm; $$NotCommonProperty_Family: SMD Pad; $$NotCommonProperty_Footprint Ref: C100; $$NotCommonProperty_Mounted: No; $$NotCommonProperty_Pin Count: 1; $$NotCommonProperty_Sense: No; $$NotCommonProperty_Status: None; CmpIndex: 265; Ref Designator: TP23; SymIndex: 2108; $$NotCommonProperty_ComponentHeight: 0mm; $$NotCommonProperty_SMD: No; $$NotCommonProperty_Socket: No; Cell Name: C100; Footprint: C100; PackageDescription: 1mm Diameter SMD Pad; Part Name: SMD_PAD_D1MM; Part Number: SMD_PAD_D1MM; Orientation: 0 = 0
TP24 = (no symbol name): Part Description: 1mm Diameter SMD Pad; Partition: Pads; $$Internal_Resolution: 00001mm; $$NotCommonProperty_Family: SMD Pad; $$NotCommonProperty_Footprint Ref: C100; $$NotCommonProperty_Mounted: No; $$NotCommonProperty_Pin Count: 1; $$NotCommonProperty_Sense: No; $$NotCommonProperty_Status: None; CmpIndex: 271; Ref Designator: TP24; SymIndex: 2108; $$NotCommonProperty_ComponentHeight: 0mm; $$NotCommonProperty_SMD: No; $$NotCommonProperty_Socket: No; Cell Name: C100; Footprint: C100; PackageDescription: 1mm Diameter SMD Pad; Part Name: SMD_PAD_D1MM; Part Number: SMD_PAD_D1MM; Orientation: 0 = 0